# EAGLE schematic mains (EAGLE 9.6.2)
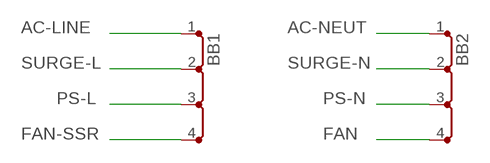
[diagram p0: schematic, sheet 1]

## Parts
BB1  TE3/4  [TE3/4]
BB2  TE3/4  [TE3/4]

## Nets
AC-LINE: BB1.1(P)
AC-NEUT: BB2.1(P)
FAN: BB2.4(P)
FAN-SSR: BB1.4(P)
PS-L: BB1.3(P)
PS-N: BB2.3(P)
SURGE-L: BB1.2(P)
SURGE-N: BB2.2(P)

## Library data of the parts
BB1 BB2 = busbar:TE3/4: BUS BAR 4 connections, grid 3 TE